# Altium project 3DP-GLCD.PrjPcb
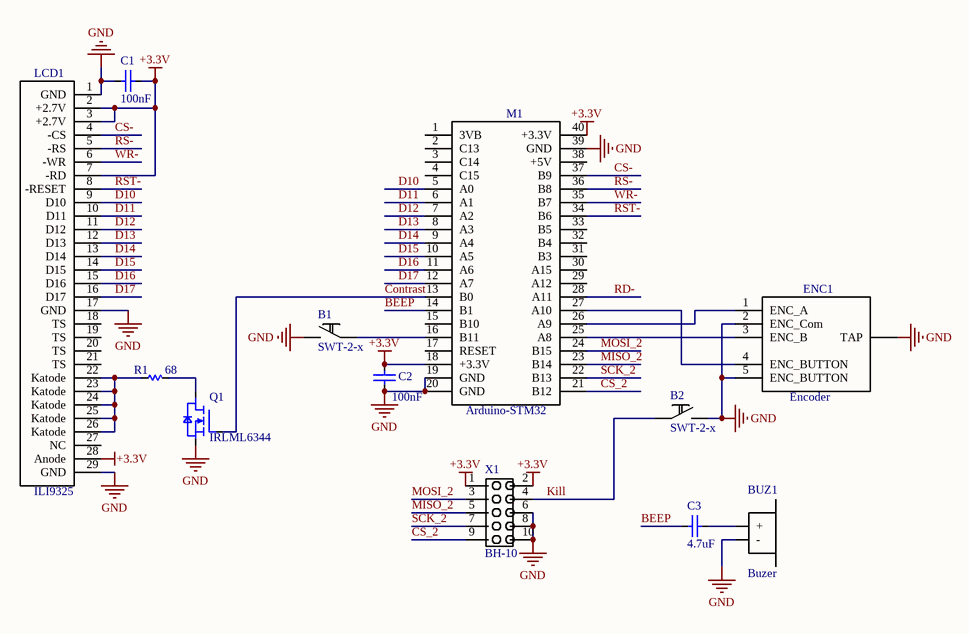
[diagram p0: 3DP-GLCD.SchDoc]
1 sheet, 12 parts. Net scope: global (net labels, ports and power ports of the same name join across sheets).
Board file: 3DP-GLCD.PcbDoc

## Sheet 3DP-GLCD.SchDoc
size A4; Engineer: Serj_K; SheetNumber: 1; SheetTotal: 1

### Parts
B1  SWT-2-x  [SWT-2-x]
B2  SWT-2-x  [SWT-2-x]
BUZ1  Buzer  [Buzer_12xx]
C1  value 100nF  [C0805_Murata]  (hidden comment: Cap)
C2  value 100nF  [C0805_Murata]  (hidden comment: Cap)
C3  value 4.7uF  [C1206_Murata]  (hidden comment: Cap)
ENC1  Encoder  [Encoder_bot]
LCD1  ILI9325  [LCD-ILI9325-29pin-top]
M1  Arduino-STM32  [ARDUINO-STM32]
Q1  IRLML6344  [SOT23-3_IR]
R1  value 68  [R0805_UniOhm]  (hidden comment: R)
X1  BH-10  [BH-10]

### Nets
+3.3V: C1.1 C2.1 LCD1.2(+2.7V) LCD1.3(+2.7V) LCD1.7(-RD) LCD1.28(Anode) M1.18(+3.3V) M1.40(+3.3V) X1.1 X1.2
GND: B1.2 B2.2 BUZ1.2(-) C1.2 C2.2 ENC1.0(TAP) ENC1.2(ENC_Com) ENC1.5(ENC_BUTTON) LCD1.1(GND) LCD1.17(GND) LCD1.29(GND) M1.19(GND) M1.20(GND) M1.39(GND) Q1.2(S) X1.6 X1.8 X1.10
BEEP: C3.1 M1.14(B1)
Contrast: M1.13(B0) Q1.1(G)
CS-: LCD1.4(-CS) M1.37(B9)
CS_2: M1.21(B12) X1.9
D10: LCD1.9(D10) M1.5(A0)
D11: LCD1.10(D11) M1.6(A1)
D12: LCD1.11(D12) M1.7(A2)
D13: LCD1.12(D13) M1.8(A3)
D14: LCD1.13(D14) M1.9(A4)
D15: LCD1.14(D15) M1.10(A5)
D16: LCD1.15(D16) M1.11(A6)
D17: LCD1.16(D17) M1.12(A7)
Kill: B2.1 X1.4
MISO_2: M1.23(B14) X1.5
MOSI_2: M1.24(B15) X1.3
RD-: M1.28(A11)
RS-: LCD1.5(-RS) M1.36(B8)
RST-: LCD1.8(-RESET) M1.34(B6)
SCK_2: M1.22(B13) X1.7
WR-: LCD1.6(-WR) M1.35(B7)
NetB1_1: B1.1 M1.16(B11)
NetBUZ1_1: BUZ1.1(+) C3.2
NetENC1_1: ENC1.1(ENC_A) M1.26(A9)
NetENC1_3: ENC1.3(ENC_B) M1.25(A8)
NetENC1_4: ENC1.4(ENC_BUTTON) M1.27(A10)
NetLCD1_22: LCD1.22(Katode) LCD1.23(Katode) LCD1.24(Katode) LCD1.25(Katode) LCD1.26(Katode) R1.1
NetQ1_3: Q1.3(D) R1.2

Not connected (* = marked no-connect by the designer): LCD1 18(TS) 19(TS) 20(TS) 21(TS) 27(NC); M1 1(3VB) 2(C13) 3(C14) 4(C15) 15(B10) 17(RESET) 29(A12) 30(A15) 31(B3) 32(B4) 33(B5) 38(+5V)

### Notes on the sheet
- Title
- Size:
- Date:
- File:
- A4
- Number:
- Time:
- Revision:
- Sheet
- of

### Library data of the parts
C1 C2 = GRM21BR71H104KA01L: PartName: GRM21; Part Label: C0805 100nF 10% X7R 50V; Manufacturer: muRata; Voltage: 50V; Tolerance: 10 %; Device: C; ShortName: C0805; Part Number: GRM21BR71H104KA01L; ClassName_u: SMD 0805; ComponentLink1Description: Datasheet; ComponentLink2Description: User Manual
C3 = GRM31CR71H475KA12L: PartName: GRM31; Part Label: C1206 4.7uF 10% X7R 50V; Manufacturer: muRata; Voltage: 50V; Tolerance: 10 %; Device: C; ShortName: C1206; Part Number: GRM31CR71H475KA12L; ClassName_u: SMD 1206; ComponentLink1Description: Datasheet; ComponentLink2Description: User Manual
ENC1 = Encoder: Rotary Encoder with button
LCD1 = LCD-ILI9325-29pin: TFT LCD
Q1 = IRLML6344TRPBF: 30 V, 5.0 A, 0.029 Ohm Single N-Channel HEXFET Power MOSFET; Manufacturer: International Rectifier; Device: Q; ShortName: NMOS; Part Number: IRLML6344TRPBF; Part Label: IRLML6344; PartName: IRLML6344; ClassName_u: N-Channel; ComponentLink1URL: \\dc2\s\Information\International Rectifier\Power_MOS\MICRO 3(SOT-23)\30 V N-channel\irlml6344pbf.pdf; ComponentLink1Description: Datasheet; ComponentLink2Description: User Manual
R1 = 0805S8F4700T50: PartName: 0805S; Part Label: R0805 470 1% TC100 150V; Manufacturer: uniOhm; TempCo: 100 ppm; Tolerance: 1 %; ShortName: R0805; Part Number: 0805S8F4700T50; ClassName_u: SMD 0805; Device: R; ComponentLink1Description: Datasheet; ComponentLink2Description: User Manual
X1 = BH-10_2